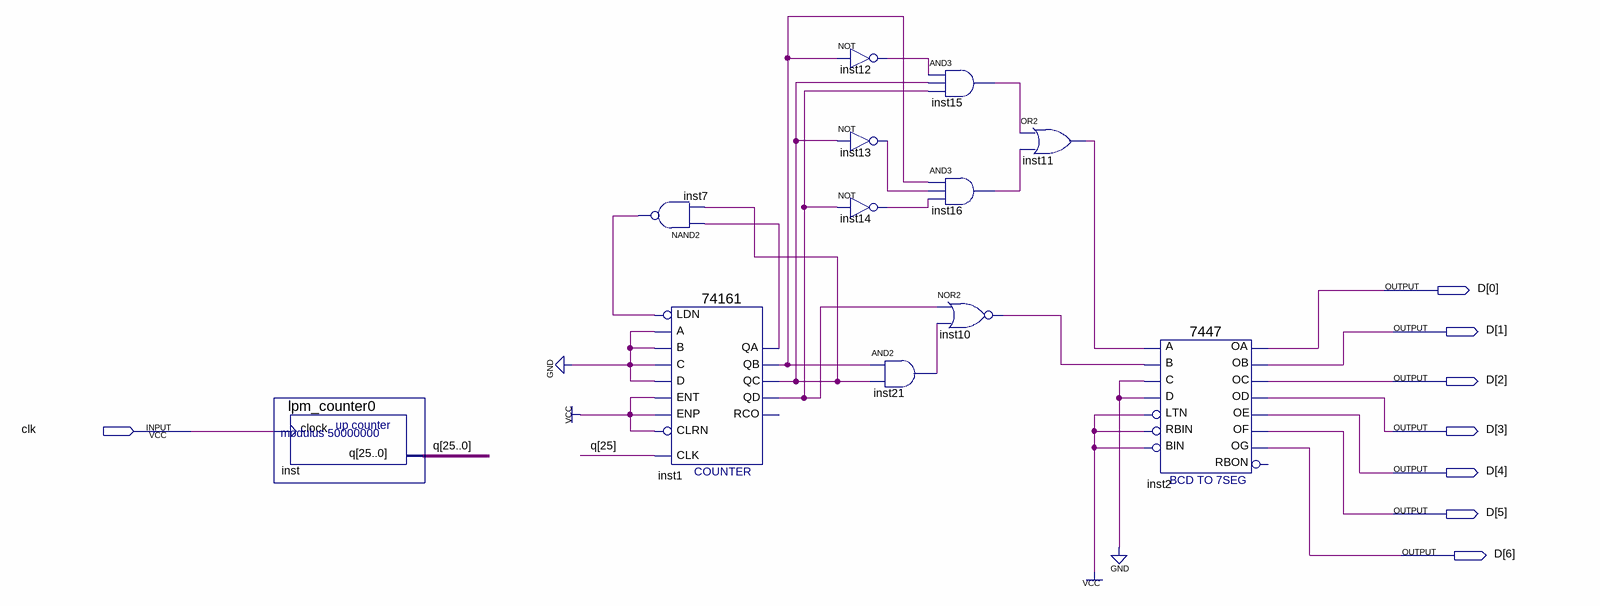
[diagram p0: schematic sheet]
// Quartus schematic 32.bdf as structural Verilog: 12 symbols, 8 pins
module \32  (
  input  clk,
  output [6:0] D
);

  wire inst1_qa, inst1_qb, inst1_qc, inst1_qd, inst7_out, inst10_out, inst11_out, inst12_out, inst13_out,
       inst14_out, inst15_out, inst16_out, inst21_out;
  wire [25:0] q;

  lpm_counter0 inst (.clock(clk), .q(q));
  nand inst7 (inst7_out, inst1_qa, inst1_qc);
  \74161  inst1 (
    .CLRN(1'b1), .CLK(q[25]), .ENP(1'b1), .LDN(inst7_out), .A(1'b0), .D(1'b0), .ENT(1'b1), .B(1'b0),
    .C(1'b0), .QD(inst1_qd), .QC(inst1_qc), .QB(inst1_qb), .QA(inst1_qa));  // open: RCO
  not inst12 (inst12_out, inst1_qb);
  not inst13 (inst13_out, inst1_qc);
  not inst14 (inst14_out, inst1_qd);
  and inst21 (inst21_out, inst1_qb, inst1_qc);
  and inst15 (inst15_out, inst12_out, inst1_qc, inst1_qd);
  and inst16 (inst16_out, inst1_qb, inst13_out, inst14_out);
  nor inst10 (inst10_out, inst1_qd, inst21_out);
  or inst11 (inst11_out, inst15_out, inst16_out);
  \7447  inst2 (
    .LTN(1'b1), .B(inst10_out), .C(1'b0), .D(1'b0), .RBIN(1'b1), .BIN(1'b1), .A(inst11_out), .OB(D[1]),
    .OC(D[2]), .OE(D[4]), .OD(D[3]), .OF(D[5]), .OG(D[6]), .OA(D[0]));  // open: RBON
endmodule
